# Altium schematic sheet +20_to_+14.schdoc
size A; SheetNumber: 3; SheetTotal: 4
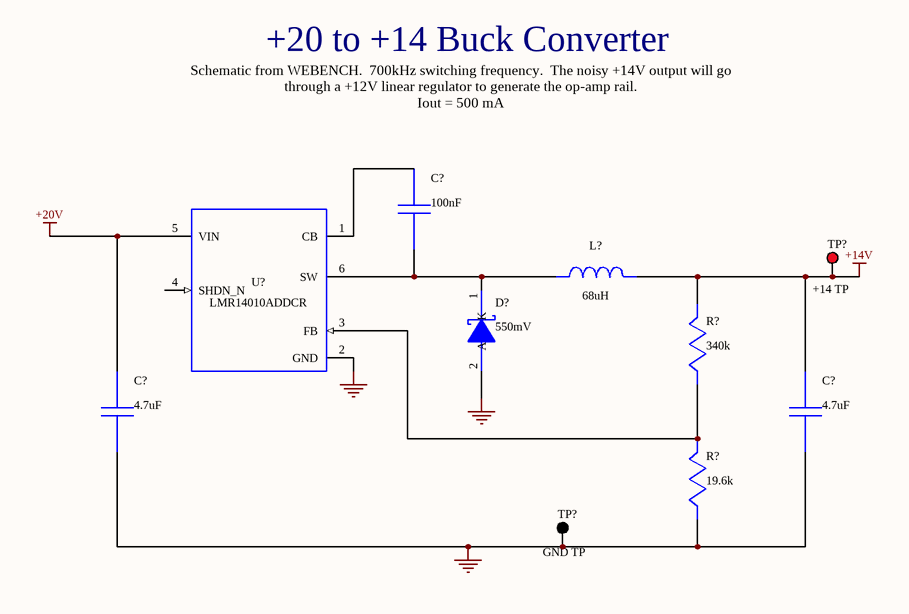
[diagram p0: +20_to_+14.schdoc]

## Parts
(Parts that share a designator on the sheet are numbered #1, #2 ... from top to bottom, then left to right.)
C?#1  value 100nF  (hidden comment: C0805C104M5RACTU)
C?#2  value 4.7uF  (hidden comment: GRM31CR71H475KA12L)
C?#3  value 4.7uF  (hidden comment: GRM31CR71H475KA12L)
D?  value 550mV  (hidden comment: SS14FL)
L?  value 68uH  (hidden comment: SRR1210-680M)
R?#1  value 340k  (hidden comment: ERJ-6ENF3403V)
R?#2  value 19.6k  (hidden comment: CRCW080519K6FKEA)
TP?#1  +14 TP  [KSTN-5010_V]
TP?#2  GND TP  [KSTN-5011_V]
U?  LMR14010ADDCR

## Nets
0: C?#2.2 C?#3.2 D?.2(A) R?#2.2 TP?#2.1 U?.2(GND)
+14V: C?#3.1 L?.2 R?#1.1 TP?#1.1
+20V: C?#2.1 U?.5(VIN)
NetC?#1_1: C?#1.1 U?.1(CB)
NetC?#1_2: C?#1.2 D?.1(K) L?.1 U?.6(SW)
NetR?#1_2: R?#1.2 R?#2.1 U?.3(FB)

Not connected (* = marked no-connect by the designer): U? 4(SHDN_N)

## Notes on the sheet
- +20 to +14 Buck Converter
- Schematic from WEBENCH.  700kHz switching frequency.  The noisy +14V output will go through a +12V linear regulator to generate the op-amp rail.
  Iout = 500 mA

## Library data of the parts
C?#1 = C0805C104M5RACTU: Manufacturer Name: Kemet; PackageReference: C0805C104M5RACTU; Manufacturer Part Number: C0805C104M5RACTU
C?#2 C?#3 = GRM31CR71H475KA12L: GRM31CR71H475KA1; Manufacturer Name: MuRata; PackageReference: GRM31CR71H475KA12L; Manufacturer Part Number: GRM31CR71H475KA12L
D? = SS14FL: Manufacturer Name: Fairchild Semiconductor; PackageReference: SS14FL; Manufacturer Part Number: SS14FL
L? = SRR1210-680M: Manufacturer Name: Bourns; PackageReference: SRR1210-680M; Manufacturer Part Number: SRR1210-680M
R?#1 = ERJ-6ENF3403V: Manufacturer Name: Panasonic; PackageReference: ERJ-6ENF3403V; Manufacturer Part Number: ERJ-6ENF3403V
R?#2 = CRCW080519K6FKEA: Manufacturer Name: Vishay-Dale; PackageReference: CRCW080519K6FKEA; Manufacturer Part Number: CRCW080519K6FKEA
TP?#1 = CMP-1672-00002-4: Test Point, Red, Through Hole, RoHS, Bulk; Manufacturer: Keystone; Contact Material: Bronze; Mounting Technology: Through Hole; RoHSCompliant: true; Pins: 1; Package Quantity: 100; ComponentLink2Description: Datasheet; Height: 8.12 mm; ComponentLink1URL: http://www.keyelco.com/; DatasheetVersion: Rev. F, 12/2013; Mount: Through Hole; PackageReference: 5010; Contact Plating: Silver; Packaging: Bulk; Colour: Red; REACH SVHC: No SVHC; PackageDescription: 1-Pin Through Hole Device, Dia 3.17 mm; ComponentLink2URL: http://www.keyelco.com/product-pdf.cfm?p=1319; ComponentLink1Description: Manufacturer URL
TP?#2 = CMP-1672-00003-4: Test Point, Black, Through Hole, RoHS, Bulk; Manufacturer: Keystone; ComponentLink2URL: http://www.keyelco.com/product-pdf.cfm?p=1320; Colour: Black; Pins: 1; REACH SVHC: No SVHC; ComponentLink1URL: http://www.keyelco.com/; PackageReference: 5011; Contact Plating: Silver; Package Quantity: 100; Packaging: Bulk; RoHSCompliant: true; Height: 8.12 mm; PackageDescription: 1-Pin Through Hole Device, Dia 3.17 mm; Mount: Through Hole; Mounting Technology: Through Hole; DatasheetVersion: Rev. F, 12/2013; ComponentLink1Description: Manufacturer URL; Contact Material: Bronze; ComponentLink2Description: Datasheet
U? = LMR14010ADDCR: Manufacturer Name: Texas Instruments; PackageReference: LMR14010ADDCR; Manufacturer Part Number: LMR14010ADDCR; Value: N/A